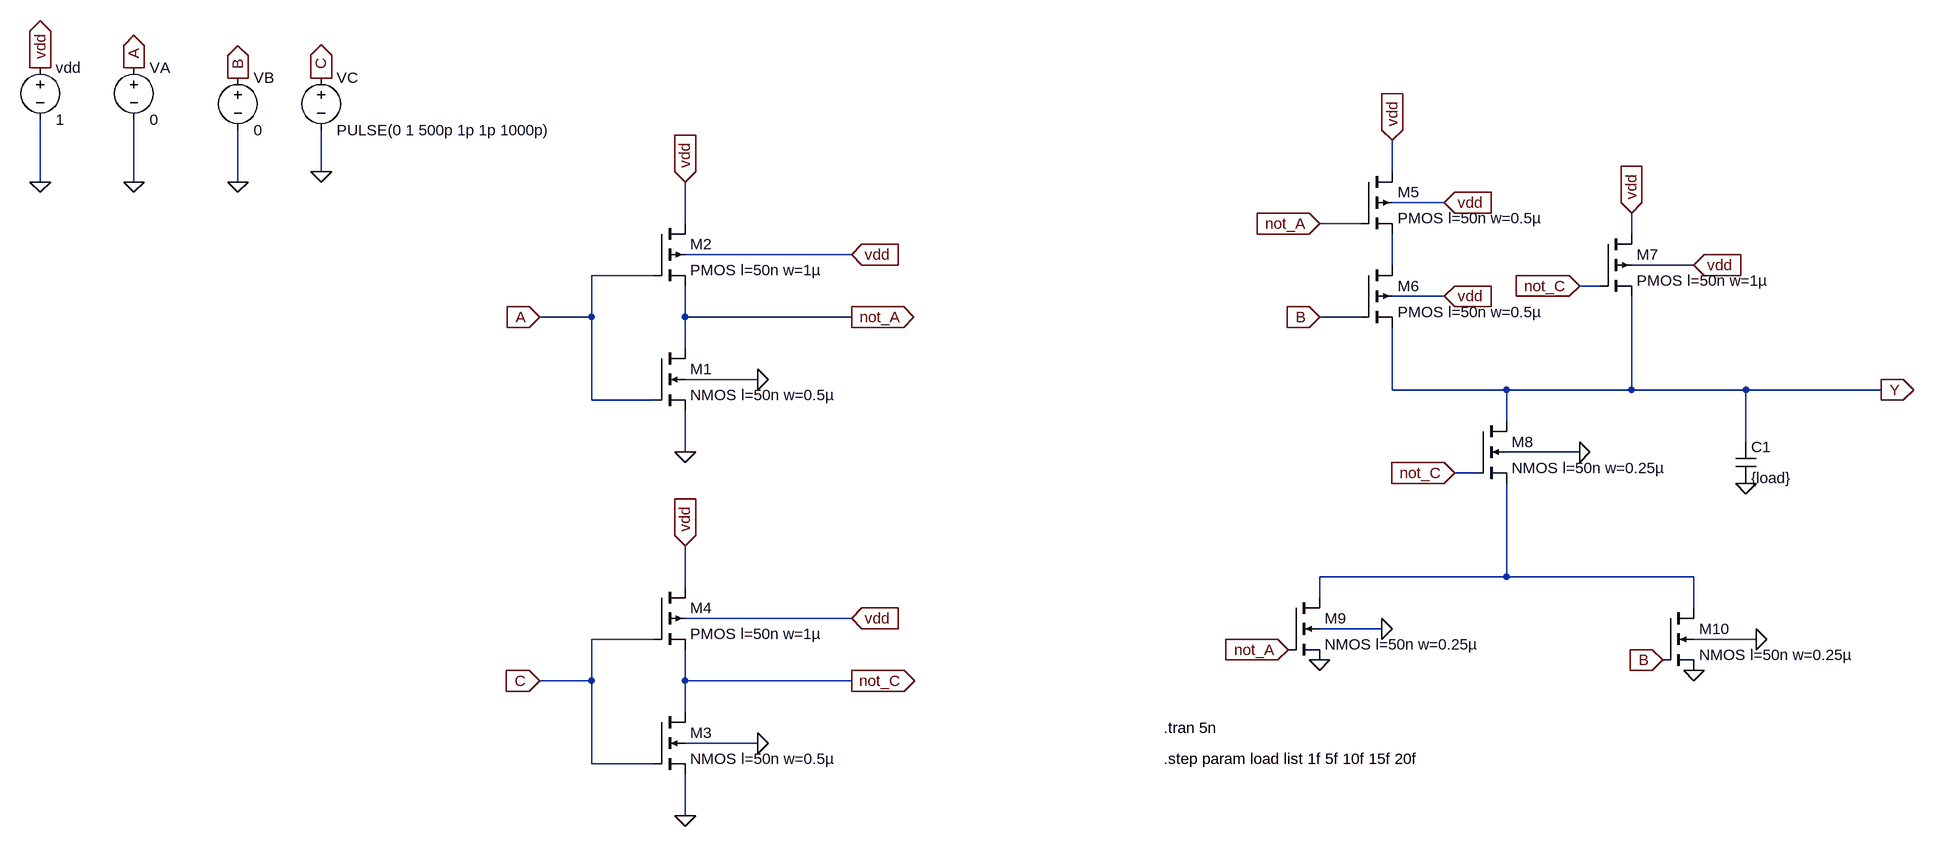
[diagram p0: schematic step.asc]
step.asc, the LTspice schematic file:
Version 4
SHEET 1 880 820
WIRE -2064 -192 -2064 -256
WIRE -416 -192 -416 -240
WIRE -2496 -176 -2496 -272
WIRE -2352 -176 -2352 -272
WIRE -2192 -176 -2192 -256
WIRE -336 -144 -416 -144
WIRE -1504 -112 -1504 -176
WIRE -464 -112 -528 -112
WIRE -48 -96 -48 -128
WIRE -1248 -64 -1504 -64
WIRE -416 -48 -416 -96
WIRE 48 -48 -48 -48
WIRE -1552 -32 -1648 -32
WIRE -96 -16 -128 -16
WIRE -336 0 -416 0
WIRE -1648 32 -1648 -32
WIRE -1648 32 -1728 32
WIRE -1504 32 -1504 -16
WIRE -1248 32 -1504 32
WIRE -464 32 -528 32
WIRE -1504 80 -1504 32
WIRE -1392 128 -1504 128
WIRE -416 144 -416 48
WIRE -240 144 -416 144
WIRE -48 144 -48 0
WIRE -48 144 -240 144
WIRE 128 144 -48 144
WIRE 336 144 128 144
WIRE -1648 160 -1648 32
WIRE -1552 160 -1648 160
WIRE -240 192 -240 144
WIRE 128 224 128 144
WIRE -1504 240 -1504 176
WIRE -128 240 -240 240
WIRE -288 272 -320 272
WIRE -240 432 -240 288
WIRE -240 432 -528 432
WIRE 48 432 -240 432
WIRE -1504 448 -1504 384
WIRE -528 464 -528 432
WIRE 48 480 48 432
WIRE -1248 496 -1504 496
WIRE -432 512 -528 512
WIRE -1552 528 -1648 528
WIRE 144 528 48 528
WIRE -1648 592 -1648 528
WIRE -1648 592 -1728 592
WIRE -1504 592 -1504 544
WIRE -1248 592 -1504 592
WIRE -1504 640 -1504 592
WIRE -1392 688 -1504 688
WIRE -1648 720 -1648 592
WIRE -1552 720 -1648 720
WIRE -1504 800 -1504 736
FLAG -1248 -64 vdd
IOPIN -1248 -64 In
FLAG -1728 32 A
IOPIN -1728 32 In
FLAG -1504 -176 vdd
IOPIN -1504 -176 In
FLAG -1248 32 not_A
IOPIN -1248 32 Out
FLAG -1504 240 0
FLAG -1392 128 0
FLAG -1248 496 vdd
IOPIN -1248 496 In
FLAG -1728 592 C
IOPIN -1728 592 In
FLAG -1504 384 vdd
IOPIN -1504 384 In
FLAG -1248 592 not_C
IOPIN -1248 592 Out
FLAG -1504 800 0
FLAG -1392 688 0
FLAG -416 -240 vdd
IOPIN -416 -240 In
FLAG -48 -128 vdd
IOPIN -48 -128 In
FLAG -336 -144 vdd
IOPIN -336 -144 In
FLAG 48 -48 vdd
IOPIN 48 -48 In
FLAG -336 0 vdd
IOPIN -336 0 In
FLAG -528 -112 not_A
IOPIN -528 -112 In
FLAG -528 32 B
IOPIN -528 32 In
FLAG -128 -16 not_C
IOPIN -128 -16 In
FLAG -128 240 0
FLAG 144 528 0
FLAG 48 576 0
FLAG -528 560 0
FLAG -432 512 0
FLAG -320 272 not_C
IOPIN -320 272 In
FLAG -576 544 not_A
IOPIN -576 544 In
FLAG 0 560 B
IOPIN 0 560 In
FLAG 336 144 Y
IOPIN 336 144 Out
FLAG 128 288 0
FLAG -2496 -176 0
FLAG -2352 -176 0
FLAG -2192 -176 0
FLAG -2064 -192 0
FLAG -2496 -352 vdd
IOPIN -2496 -352 Out
FLAG -2352 -352 A
IOPIN -2352 -352 Out
FLAG -2192 -336 B
IOPIN -2192 -336 Out
FLAG -2064 -336 C
IOPIN -2064 -336 Out
SYMBOL nmos4 -1552 80 R0
SYMATTR InstName M1
SYMATTR Value NMOS l=50n w=0.5µ
SYMATTR Value2 l=50n w=0.5µ
SYMBOL pmos4 -1552 -112 R0
SYMATTR InstName M2
SYMATTR Value PMOS l=50n w=1µ
SYMATTR Value2 l=50n w=1µ
SYMBOL nmos4 -1552 640 R0
SYMATTR InstName M3
SYMATTR Value NMOS l=50n w=0.5µ
SYMATTR Value2 l=50n w=0.5µ
SYMBOL pmos4 -1552 448 R0
SYMATTR InstName M4
SYMATTR Value PMOS l=50n w=1µ
SYMATTR Value2 l=50n w=1µ
SYMBOL pmos4 -464 -192 R0
SYMATTR InstName M5
SYMATTR Value PMOS l=50n w=0.5µ
SYMATTR Value2 l=50n w=0.5µ
SYMBOL pmos4 -464 -48 R0
SYMATTR InstName M6
SYMATTR Value PMOS l=50n w=0.5µ
SYMATTR Value2 l=50n w=0.5µ
SYMBOL pmos4 -96 -96 R0
SYMATTR InstName M7
SYMATTR Value PMOS l=50n w=1µ
SYMATTR Value2 l=50n w=1µ
SYMBOL nmos4 -288 192 R0
SYMATTR InstName M8
SYMATTR Value NMOS l=50n w=0.25µ
SYMATTR Value2 l=50n w=0.25µ
SYMBOL nmos4 -576 464 R0
SYMATTR InstName M9
SYMATTR Value NMOS l=50n w=0.25µ
SYMATTR Value2 l=50n w=0.25µ
SYMBOL nmos4 0 480 R0
SYMATTR InstName M10
SYMATTR Value NMOS l=50n w=0.25µ
SYMBOL cap 112 224 R0
SYMATTR InstName C1
SYMATTR Value {load}
SYMBOL voltage -2496 -368 R0
SYMATTR InstName vdd
SYMATTR Value 1
SYMBOL voltage -2352 -368 R0
WINDOW 123 0 0 Left 0
WINDOW 39 0 0 Left 0
SYMATTR InstName VA
SYMATTR Value 0
SYMBOL voltage -2192 -352 R0
SYMATTR InstName VB
SYMATTR Value 0
SYMBOL voltage -2064 -352 R0
WINDOW 123 0 0 Left 0
WINDOW 39 0 0 Left 0
SYMATTR InstName VC
SYMATTR Value PULSE(0 1 500p 1p 1p 1000p)
TEXT -768 664 Left 2 !.tran 5n
TEXT -768 712 Left 2 !.step param load list 1f 5f 10f 15f 20f

The netlist it stands for:
* step.asc
M1 not_A A 0 0 NMOS l=50n w=0.5µ l=50n w=0.5µ
M2 vdd A not_A vdd PMOS l=50n w=1µ l=50n w=1µ
M3 not_C C 0 0 NMOS l=50n w=0.5µ l=50n w=0.5µ
M4 vdd C not_C vdd PMOS l=50n w=1µ l=50n w=1µ
M5 vdd not_A N001 vdd PMOS l=50n w=0.5µ l=50n w=0.5µ
M6 N001 B Y vdd PMOS l=50n w=0.5µ l=50n w=0.5µ
M7 vdd not_C Y vdd PMOS l=50n w=1µ l=50n w=1µ
M8 Y not_C N002 0 NMOS l=50n w=0.25µ l=50n w=0.25µ
M9 N002 not_A 0 0 NMOS l=50n w=0.25µ l=50n w=0.25µ
M10 N002 B 0 0 NMOS l=50n w=0.25µ
C1 Y 0 {load}
vdd vdd 0 1
VA A 0 0
VB B 0 0
VC C 0 PULSE(0 1 500p 1p 1p 1000p)
.model NMOS NMOS
.model PMOS PMOS
.lib standard.mos
.tran 5n
.step param load list 1f 5f 10f 15f 20f
.backanno
.end

* Results of the author's LTspice run, read from the files saved beside the schematic
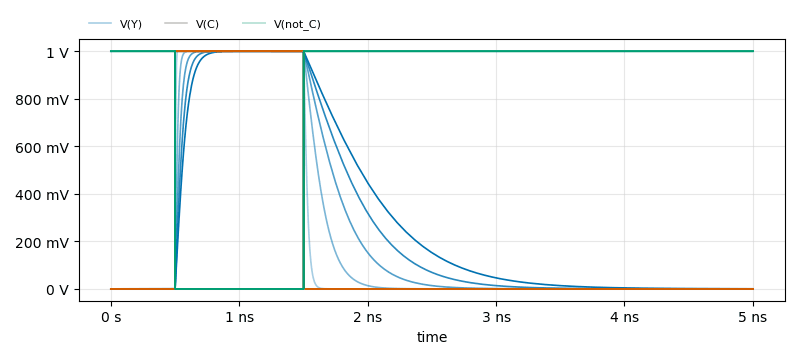
[diagram p1: Transient Analysis of step.asc, plotted from the saved traces]
* Transient Analysis, 5 runs:
*   V(Y) [run 1]: min 120.8 nV, max 1 V, average 204.9 mV, rms 449.6 mV, last 120.8 nV
*   V(Y) [run 2]: min 120.8 nV, max 1 V, average 224.4 mV, rms 458.9 mV, last 120.8 nV
*   V(Y) [run 3]: min 120.8 nV, max 1 V, average 248.7 mV, rms 470.3 mV, last 171.3 nV
*   V(Y) [run 4]: min 120.8 nV, max 1 V, average 273 mV, rms 481.3 mV, last 17.35 µV
*   V(Y) [run 5]: min 120.8 nV, max 1 V, average 297.3 mV, rms 492.2 mV, last 318.1 µV
*   V(C) [run 1]: min 0 V, max 1 V, average 200.2 mV, rms 447.4 mV, last 0 V
*   V(C) [run 2]: min 0 V, max 1 V, average 200.2 mV, rms 447.4 mV, last 0 V
*   V(C) [run 3]: min 0 V, max 1 V, average 200.2 mV, rms 447.4 mV, last 0 V
*   V(C) [run 4]: min 0 V, max 1 V, average 200.2 mV, rms 447.4 mV, last 0 V
*   V(C) [run 5]: min 0 V, max 1 V, average 200.2 mV, rms 447.4 mV, last 0 V
*   V(not_C) [run 1]: min 0 V, max 1 V, average 799.8 mV, rms 894.3 mV, last 1 V
*   V(not_C) [run 2]: min 0 V, max 1 V, average 799.8 mV, rms 894.3 mV, last 1 V
*   V(not_C) [run 3]: min 0 V, max 1 V, average 799.8 mV, rms 894.3 mV, last 1 V
*   V(not_C) [run 4]: min 0 V, max 1 V, average 799.8 mV, rms 894.3 mV, last 1 V
*   V(not_C) [run 5]: min 0 V, max 1 V, average 799.8 mV, rms 894.3 mV, last 1 V